# Altium schematic sheet Feedback.SchDoc
size Tabloid
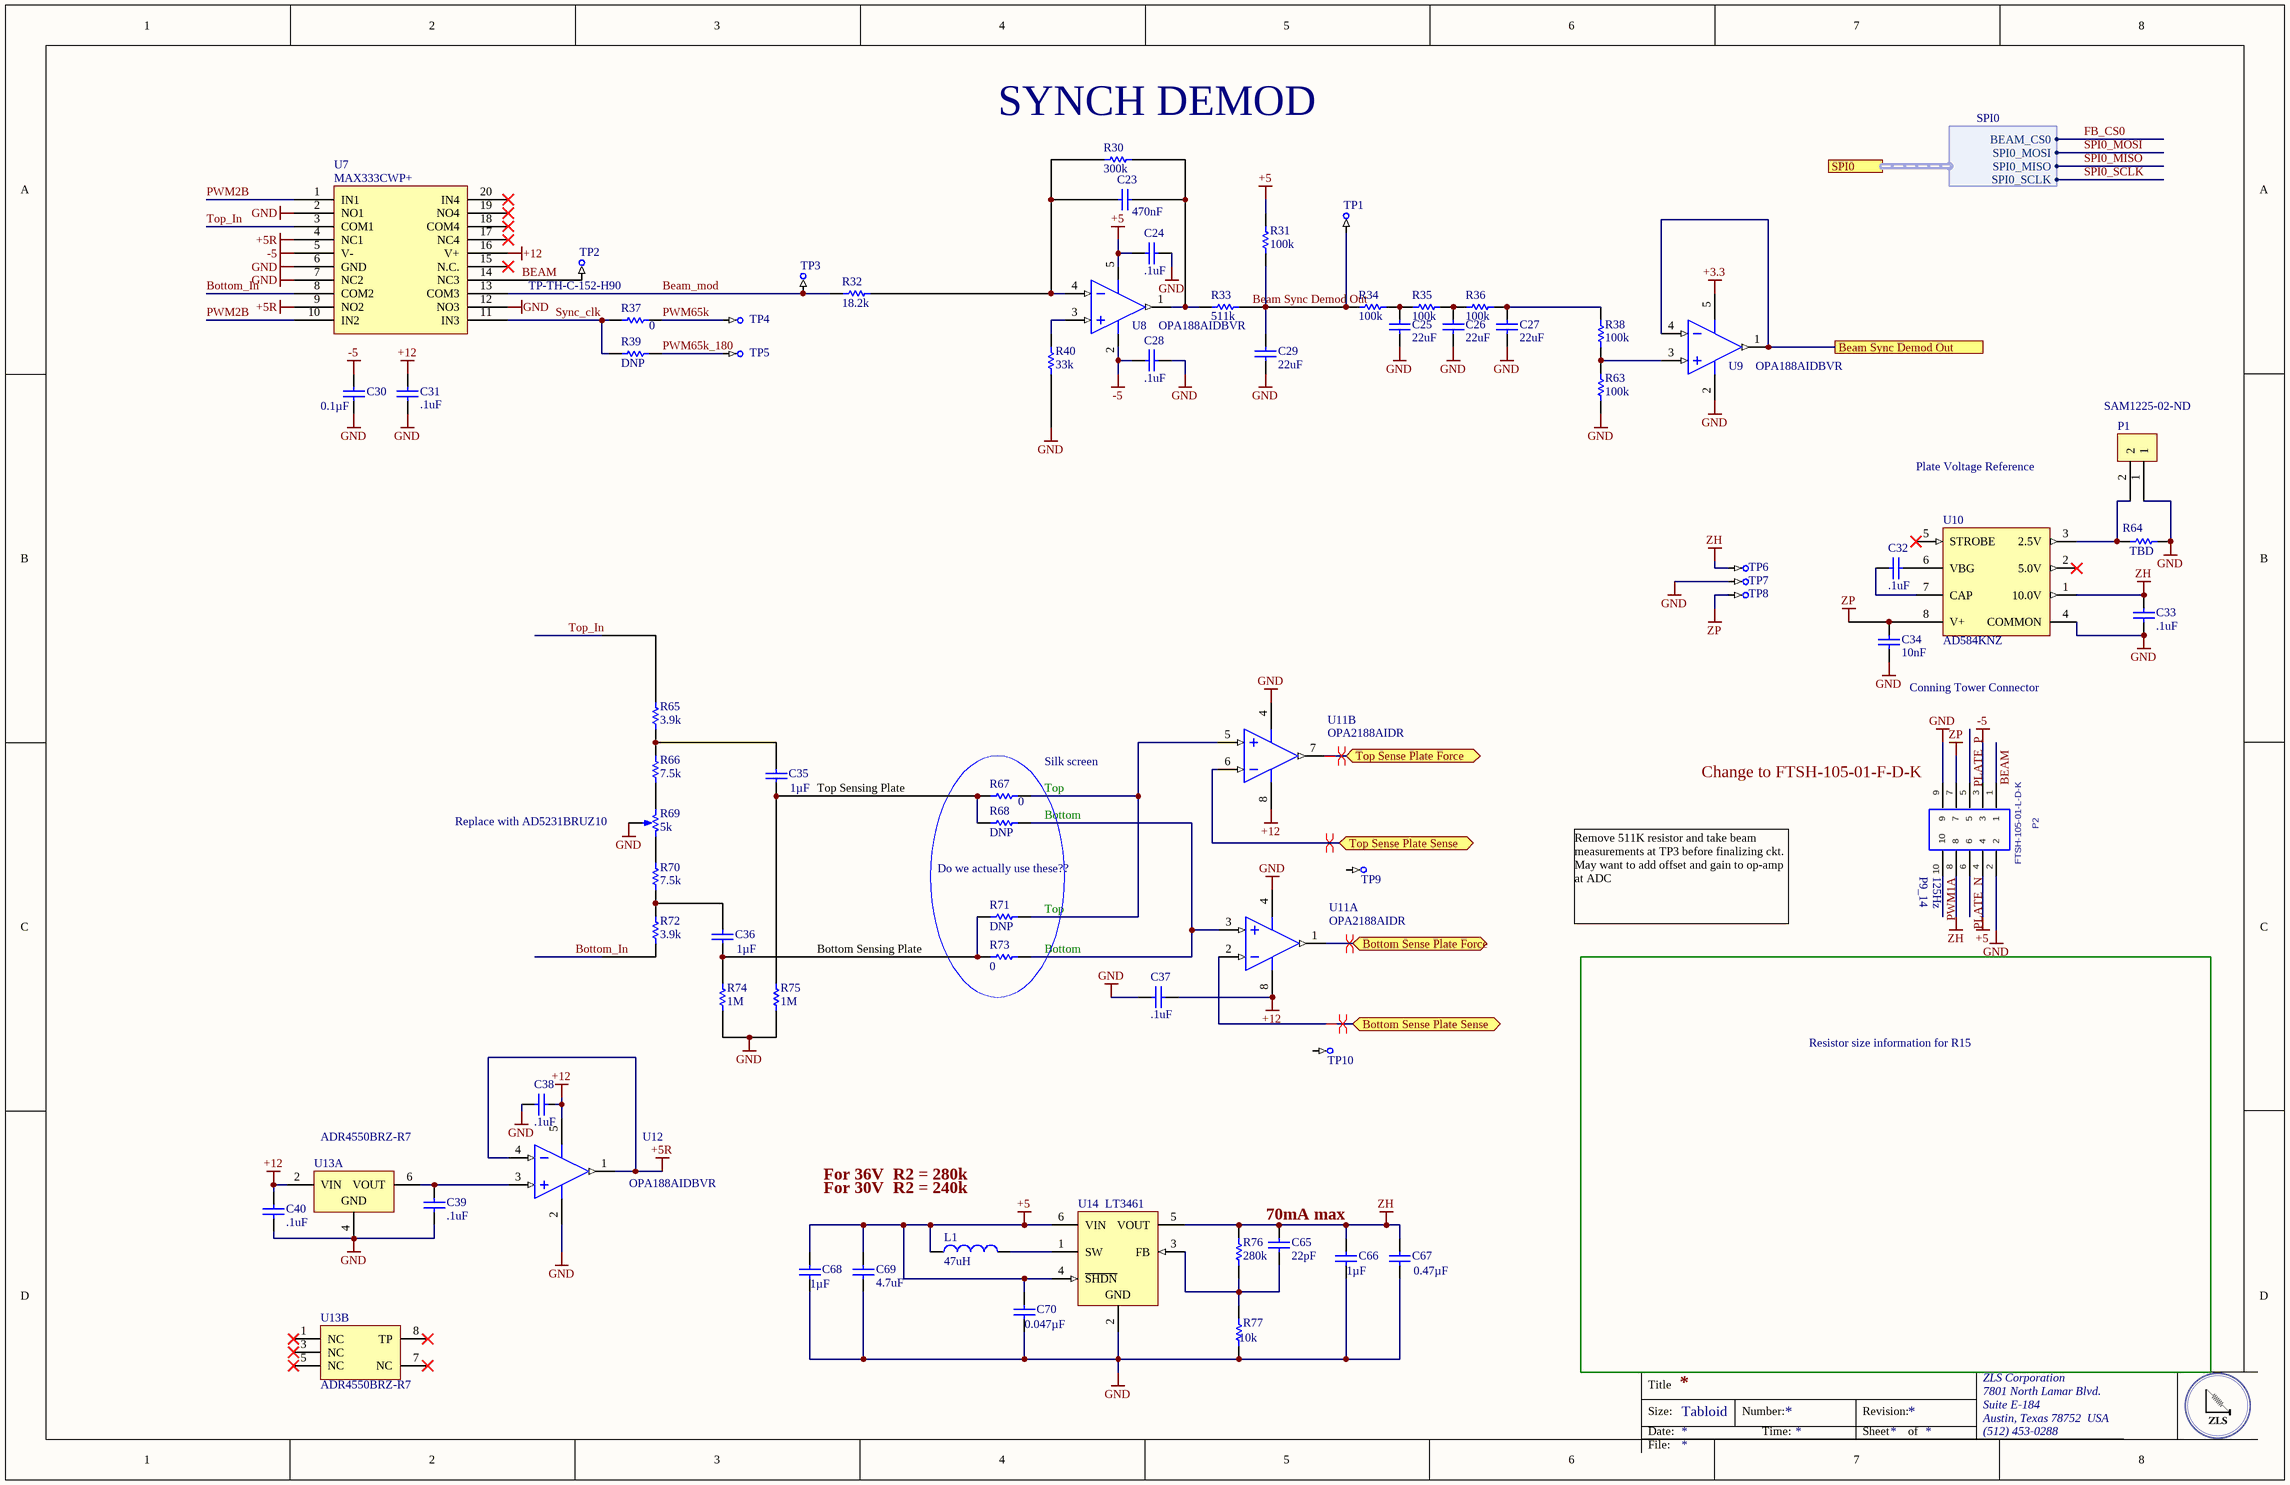
[diagram p0: Feedback.SchDoc]

## Parts
C23  470nF  [CAPC0805(2012)75_L]
C24  .1uF  [CAPC0805(2012)75_L]
C25  22uF  [CAPC0805(2012)75_L]
C26  22uF  [CAPC0805(2012)75_L]
C27  22uF  [CAPC0805(2012)75_L]
C28  .1uF  [CAPC0805(2012)75_L]
C29  22uF  [CAPC0805(2012)75_L]
C30  Capacitance: 0.1µF  [CAPC0805(2012)145_N]  (hidden comment: CAP CER 0.1UF 25V X7R 0805)
C31  .1uF  [CAPC0805(2012)75_L]
C32  .1uF  [CAPC0805(2012)75_M]
C33  .1uF  [CAPC0805(2012)75_M]
C34  Capacitance: 10nF  [CAPC0805(2012)145_N]  (hidden comment: Multilayer Ceramic Capacitors MLCC - SMD/SMT 0.01uF 50volts 10% X7R)
C35  Capacitance: 1µF  [CAPC0805(2012)155_L]  (hidden comment: CAP CER 1UF 25V X7R 0805)
C36  Capacitance: 1µF  [CAPC0805(2012)155_L]  (hidden comment: CAP CER 1UF 25V X7R 0805)
C37  .1uF  [CAPC0805(2012)75_M]
C38  .1uF  [CAPC0805(2012)75_M]
C39  .1uF  [CAPC0805(2012)75_M]
C40  .1uF  [CAPC0805(2012)75_M]
C65  22pF  [CAPC1206(3216)170_L]
C66  Capacitance: 1µF  [CAPC1210(3225)100_N]  (hidden comment: CAP CER 1UF 50V X7R 1210)
C67  Capacitance: 0.47µF  [CAPC1206(3216)190_N]  (hidden comment: CAP CER 0.47UF 50V X7R 1206)
C68  Capacitance: 1µF  [CAPC0805(2012)145_N]  (hidden comment: CAP CER 1UF 16V X7R 0805)
C69  4.7uF  [CAPC0805(2012)145_M]
C70  Capacitance: 0.047µF  [CAPC0805(2012)145_N]  (hidden comment: CAP CER 0.047UF 16V X7R 0603)
L1  47uH  [C1210]
P1  Supplier Part Number 1: SAM1225-02-ND  [SSW-102-02-G-S-RA]  (hidden comment: SSW-102-02-G-S-RA)
P2  FTSH-105-01-L-D-K  [FTSH-105-01-XXX-D-K]
R30  300k  [RESC0805(2012)_L]
R31  100k  [RESC0805(2012)_L]
R32  18.2k  [RESC0805(2012)_L]
R33  511k  [RESC0805(2012)_L]
R34  100k  [RESC0805(2012)_L]
R35  100k  [RESC0805(2012)_L]
R36  100k  [RESC0805(2012)_L]
R37  0  [RESC0805(2012)_L]
R38  100k  [RESC0805(2012)_L]
R39  DNP  [RESC0805(2012)_L]
R40  33k  [RESC0805(2012)_L]
R63  100k  [RESC0805(2012)_L]
R64  TBD  [VH102K]
R65  3.9k  [RESC0805(2012)_L]
R66  7.5k  [RESC0805(2012)_L]
R67  0  [RESC0805(2012)_L]
R68  DNP  [RESC0805(2012)_L]
R69  Resistance (Ohms): 5k  [Trimmer 2.54]  (hidden comment: TRIMMER 5K OHM 0.25W PC PIN)
R70  7.5k  [RESC0805(2012)_L]
R71  DNP  [RESC0805(2012)_L]
R72  3.9k  [RESC0805(2012)_L]
R73  0  [RESC0805(2012)_L]
R74  1M  [RESC0805(2012)_L]
R75  1M  [RESC0805(2012)_L]
R76  Resistance (Ohms): 280k  [RESC0805(2012)_M]  (hidden comment: RES SMD 280K OHM 1% 1/8W 0805)
R77  Resistance (Ohms): 10k  [RESC0805(2012)_M]  (hidden comment: RES SMD 10K OHM 1% 1/8W 0805)
TP1  TP-TH-C-152-H90  [TP-TH-C-152-H90]  (value not drawn)  (no BOM)
TP2  TP-TH-C-152-H90  [TP-TH-C-152-H90]  (no BOM)
TP3  TP-TH-C-152-H90  [TP-TH-C-152-H90]  (value not drawn)  (no BOM)
TP4  TP-TH-C-152-H90  [TP-TH-C-152-H90]  (value not drawn)  (no BOM)
TP5  TP-TH-C-152-H90  [TP-TH-C-152-H90]  (value not drawn)  (no BOM)
TP6  TP-TH-C-152-H90  [TP-TH-C-152-H90]  (value not drawn)  (no BOM)
TP7  TP-TH-C-152-H90  [TP-TH-C-152-H90]  (value not drawn)  (no BOM)
TP8  TP-TH-C-152-H90  [TP-TH-C-152-H90]  (value not drawn)  (no BOM)
TP9  TP-TH-C-152-H90  [TP-TH-C-152-H90]  (value not drawn)  (no BOM)
TP10  TP-TH-C-152-H90  [TP-TH-C-152-H90]  (value not drawn)  (no BOM)
U7  MAX333CWP+  [TSOP65P640X90-20N]
U8  OPA188AIDBVR  [DBV0005A_M]
U9  OPA188AIDBVR  [DBV0005A_M]
U10  AD584KNZ  [ADI-N-8]
U11  OPA2188AIDR  [D0008A_L]  (parts A,B of 2)
U12  OPA188AIDBVR  [DBV0005A_M]
U13  ADR4550BRZ-R7  [ADI-R-8_M]  (parts A,B of 2)
U14  LT3461  [LT-S6-6-TSOT-23_N]

## Ports
Beam Sync Demod Out, Bottom Sense Plate Force, Bottom Sense Plate Sense, SPI0 (harness SPI0), Top Sense Plate Force, Top Sense Plate Sense

## Harnesses
SPI0: BEAM_CS0, SPI0_MOSI, SPI0_MISO, SPI0_SCLK

## Nets
+3.3: U9.5(V+)
+5: C24.1 C68.2 C69.2 C70.2 L1.1 P2.4 R31.2 U8.5(V+) U14.4(~{SHDN}) U14.6(VIN)
+5R: U7.4(NC1) U7.9(NO2) U12.1(OUT) U12.4(IN-)
+12: C31.2 C37.2 C38.2 C40.2 U7.16(V+) U11.8(V+) U12.5(V+) U13.2(VIN)
-5: C28.1 C30.1 P2.3 U7.5(V-) U8.2(V-)
GND: C24.2 C25.1 C26.1 C27.1 C28.2 C29.1 C30.2 C31.1 C33.1 C34.2 C37.1 C38.1 C39.1 C40.1 C66.1 C67.1 C68.1 C69.1 C70.1 P1.1 P2.2 P2.9 R40.1 R63.1 R64.2 R69.2(b) R74.1 R75.1 R77.2 TP7.1 U7.2(NO1) U7.6(GND) U7.7(NC2) U7.12(NO3) U9.2(V-) U10.4(COMMON) U11.4(V-) U12.2(V-) U13.4(GND) U14.2(GND)
ZH: C33.2 C65.2 C66.2 C67.2 P2.8 R76.1 TP6.1 U10.1(10.0V) U14.5(VOUT)
ZP: C34.1 P2.7 TP8.1 U10.8(V+)
BEAM: P2.1 TP2.1 U7.14(NC3)
Beam Sync Demod Out: C29.2 R31.1 R33.1 R34.2 TP1.1
Beam Sync Demod Out: U9.1(OUT) U9.4(IN-) ; port Beam Sync Demod Out  [a separate net that carries the same name]
Beam_mod: R32.2 TP3.1 U7.13(COM3)
Bottom Sense Plate Force: U11.1(OUT_A) ; port Bottom Sense Plate Force
Bottom Sense Plate Sense: U11.2(IN_A-) ; port Bottom Sense Plate Sense
Bottom_In: R72.1 U7.8(COM2)
FB_CS0: port SPI0.BEAM_CS0
PLATE_N: P2.6
PLATE_P: P2.5
PWM1A: P2.10
PWM2B: U7.1(IN1) U7.10(IN2)
PWM65k: R37.1 TP4.1
PWM65k_180: R39.1 TP5.1
SPI0_MISO: port SPI0.SPI0_MISO
SPI0_MOSI: port SPI0.SPI0_MOSI
SPI0_SCLK: port SPI0.SPI0_SCLK
Sync_clk: R37.2 R39.2 U7.11(IN3)
Top Sense Plate Force: U11.7(OUT_B) ; port Top Sense Plate Force
Top Sense Plate Sense: U11.6(IN_B-) ; port Top Sense Plate Sense
Top_In: R65.2 U7.3(COM1)
NetC23_1: C23.1 R30.2 R32.1 U8.4(IN-)
NetC23_2: C23.2 R30.1 R33.2 U8.1(OUT)
NetC25_2: C25.2 R34.1 R35.2
NetC26_2: C26.2 R35.1 R36.2
NetC27_2: C27.2 R36.1 R38.2
NetC32_1: C32.1 U10.7(CAP)
NetC32_2: C32.2 U10.6(VBG)
NetC35_1: C35.1 R67.2 R68.2 R75.2
NetC35_2: C35.2 R65.1 R66.2
NetC36_1: C36.1 R71.2 R73.2 R74.2
NetC36_2: C36.2 R70.1 R72.2
NetC39_2: C39.2 U12.3(IN+) U13.6(VOUT)
NetC65_1: C65.1 R76.2 R77.1 U14.3(FB)
NetL1_2: L1.2 U14.1(SW)
NetP1_2: P1.2 R64.1 U10.3(2.5V)
NetR38_1: R38.1 R63.2 U9.3(IN+)
NetR40_2: R40.2 U8.3(IN+)
NetR66_1: R66.1 R69.1(a)
NetR67_1: R67.1 R71.1 U11.5(IN_B+)
NetR68_1: R68.1 R73.1 U11.3(IN_A+)
NetR69_3: R69.3(c) R70.2

Not connected (* = marked no-connect by the designer): TP9 1; TP10 1; U7 15(N.C.)* 17(NC4)* 18(COM4)* 19(NO4)* 20(IN4)*; U10 2(5.0V)* 5(STROBE)*; U13 1(NC)* 3(NC)* 5(NC)* 7(NC)* 8(TP)*

## Layout directives
differential pair: Bottom Sense Plate Force, Bottom Sense Plate Sense, Top Sense Plate Force, Top Sense Plate Sense

## Notes on the sheet
- (near R30) SYNCH DEMOD
- Plate Voltage Reference
- Conning Tower Connector
- Silk screen
- (near R69) Replace with AD5231BRUZ10
- (near C35) Top Sensing Plate
- Top
- Bottom
- (near P2) Change to FTSH-105-01-F-D-K
- Do we actually use these??
- (near P2) P9_14
- (near P2) 125Hz
- Bottom Sensing Plate
- (near R71) Top
- Remove 511K resistor and take beam measurements at TP3 before finalizing ckt.
  May want to add offset and gain to op-amp at ADC
- Resistor size information for R15
- For 36V  R2 = 280k
- For 30V  R2 = 240k
- (near C65) 70mA max
- Title
- Size:
- Date:
- Tabloid
- Number:
- Time:
- Revision:
- Sheet
- of
- ZLS Corporation
- 7801 North Lamar Blvd.
- Suite E-184
- Austin, Texas 78752  USA
- (512) 453-0288
- File:

## Library data of the parts
C23 = CMP-1036-02117-1: CAP 150pF 16V ±10% 0805 (2012 Metric) Thickness 0.75mm SMD; Case-EIA: 0805; Tolerance: Â±10%; Value: .47uF; Case-Metric: 2012; Technology: SMT; Max Thickness: 0.75 mm; Rated Voltage: 16 V
C24-C29 C31 = CMP-1036-02117-1: CAP 150pF 16V ±10% 0805 (2012 Metric) Thickness 0.75mm SMD; Case-EIA: 0805; Tolerance: Â±10%; Case-Metric: 2012; Technology: SMT; Max Thickness: 0.75 mm; Rated Voltage: 16 V
  C24 C28 C31: Value: .1uF
  C25-C27 C29: Value: 22uF
C30 = CMP-1036-04795-1: Manufacturer: Murata Electronics North America; Manufacturer Part Number: GRM21BR71E104KA01L; Tolerance: ±10%; Supplier 1: Digi-Key; Supplier Part Number 1: 490-1673-6-ND; RoHS: RoHS Compliant; Category: Capacitors; Stock 1: 891652; Pricing 1: 1=0.2, 10=0.145, 100=0.0683, 500=0.04788, 1000=0.03964 (USD); Packaging: Digi-Reel®; Part Status: Active; Voltage - Rated: 25V; Temperature Coefficient: X7R; Operating Temperature: -55°C ~ 125°C; Features: -; Ratings: -; Applications: General Purpose; Mounting Type: Surface Mount, MLCC; Package / Case: 0805 (2012 Metric); Size / Dimension: 0.079" L x 0.049" W (2.00mm x 1.25mm); Height - Seated (Max): -; Thickness (Max): 0.053" (1.35mm); Lead Spacing: -; Lead Style: -; ComponentLink1URL: http://www.murata.com/~/media/webrenewal/support/library/catalog/products/capacitor/mlcc/c02e.ashx; ComponentLink1Description: http://www.murata.com/~/media/webrenewal/support/library/catalog/products/capacitor/mlcc/c02e.ashx
C32 C33 C37-C40 = CMP-1036-01414-1: CAP 33pF 25V ±2% 0805 (2012 Metric) Thickness 0.75mm SMD; Tolerance: Â±2%; Case-Metric: 2012; Case-EIA: 0805; Value: .1uF; Max Thickness: 0.75 mm; Rated Voltage: 25 V; Technology: SMT
C34 = CMP-1036-04795-1: Manufacturer: Kemet; Manufacturer Part Number: C0805C103K5RACAUTO; Voltage Rating: 50V; Supplier 1: Digi-Key; Supplier Part Number 1: 399-6924-1-ND; Stock 1: 63236; Pricing 1: 1=0.12, 10=0.087, 100=0.041, 500=0.0287, 1000=0.0238 (USD); Mount: Surface Mount; Case/Package: 0805; Case Code (Metric): 2012; Case Code (Imperial): 0805; Dielectric Material: Ceramic; Contact Plating: Tin; Min Operating Temperature: -55°C; Max Operating Temperature: 125°C; Tolerance: 10%; Packaging: Tape and Reel; Package Quantity: 1; Voltage Rating (DC): 50V; Dielectric: X7R; Termination: SMD/SMT; Length: 2mm; Height: 0.78mm; Width: 0.049inch; Thickness: 0.035inch; Depth: 1.25mm; Radiation Hardening: No; REACH SVHC: No SVHC; ComponentLink1URL: https://datasheet.ciiva.com/22700/1693454-22700519.pdf; ComponentLink1Description: https://datasheet.ciiva.com/22700/1693454-22700519.pdf; ComponentLink2URL: https://datasheet.ciiva.com/7842/1693454-7842175.pdf; ComponentLink2Description: https://datasheet.ciiva.com/7842/1693454-7842175.pdf
C35 C36 = CMP-1036-04882-1: Manufacturer: Murata Electronics North America; Manufacturer Part Number: GRM21BR71E105KA99L; Tolerance: ±10%; Supplier 1: Digi-Key; Supplier Part Number 1: 490-6484-6-ND; RoHS: RoHS Compliant; Category: Capacitors; Stock 1: 295074; Pricing 1: 1=0.14, 10=0.099, 100=0.0468, 500=0.0328, 1000=0.02715 (USD); Packaging: Digi-Reel®; Part Status: Active; Voltage - Rated: 25V; Temperature Coefficient: X7R; Operating Temperature: -55°C ~ 125°C; Features: -; Ratings: -; Applications: General Purpose; Mounting Type: Surface Mount, MLCC; Package / Case: 0805 (2012 Metric); Size / Dimension: 0.079" L x 0.049" W (2.00mm x 1.25mm); Height - Seated (Max): -; Thickness (Max): 0.053" (1.35mm); Lead Spacing: -; Lead Style: -; ComponentLink1URL: http://www.murata.com/~/media/webrenewal/support/library/catalog/products/capacitor/mlcc/c02e.ashx; ComponentLink1Description: http://www.murata.com/~/media/webrenewal/support/library/catalog/products/capacitor/mlcc/c02e.ashx
C65 = CMP-1037-04573-1: CAP CER 22PF 50V C0G/NP0 1206; Manufacturer: KEMET; Manufacturer Part Number: C1206C220K5GACTU; Tolerance: ±10%; Temperature Coefficient: C0G, NP0; Supplier 1: Digi-Key; Supplier Part Number 1: 399-8165-1-ND; RoHS: RoHS Compliant; Category: Capacitors; Stock 1: 35613; Pricing 1: 1=0.18, 10=0.128, 100=0.06, 500=0.04208, 1000=0.03483 (USD); Packaging: Cut Tape (CT); Part Status: Active; Voltage - Rated: 50V; Operating Temperature: -55°C ~ 125°C; Features: Low ESL; Ratings: -; Applications: General Purpose; Failure Rate: -; Mounting Type: Surface Mount, MLCC; Package / Case: 1206 (3216 Metric); Size / Dimension: 0.126" L x 0.063" W (3.20mm x 1.60mm); Height - Seated (Max): -; Thickness (Max): 0.035" (0.88mm); Lead Spacing: -; Lead Style: -; ComponentLink1URL: http://www.kemet.com/docfinder?Partnumber=C1206C220K2GACTU; ComponentLink1Description: http://www.kemet.com/docfinder?Partnumber=C1206C220K2GACTU
C66 = CMP-1038-01123-1: Manufacturer: Taiyo Yuden; Manufacturer Part Number: UMK325B7105KH-T; Tolerance: ±10%; Supplier 1: Digi-Key; Supplier Part Number 1: 587-1366-1-ND; RoHS: RoHS Compliant; Category: Capacitors; Stock 1: 23864; Pricing 1: 1=0.36, 10=0.247, 100=0.1398, 500=0.0987, 1000=0.08637 (USD); Packaging: Cut Tape (CT); Part Status: Active; Voltage - Rated: 50V; Temperature Coefficient: X7R; Operating Temperature: -55°C ~ 125°C; Features: -; Ratings: -; Applications: General Purpose; Mounting Type: Surface Mount, MLCC; Package / Case: 1210 (3225 Metric); Size / Dimension: 0.126" L x 0.098" W (3.20mm x 2.50mm); Height - Seated (Max): -; Thickness (Max): 0.063" (1.60mm); Lead Spacing: -; Lead Style: -; ComponentLink1URL: http://www.yuden.co.jp/productdata/catalog/en/mlcc_all_e.pdf; ComponentLink1Description: http://www.yuden.co.jp/productdata/catalog/en/mlcc_all_e.pdf
C67 = CMP-1037-04570-1: Manufacturer: Taiyo Yuden; Manufacturer Part Number: UMK316B7474KL-T; Tolerance: ±10%; Supplier 1: Digi-Key; Supplier Part Number 1: 587-1325-1-ND; RoHS: RoHS Compliant; Category: Capacitors; Stock 1: 8658; Pricing 1: 1=0.3, 10=0.203, 100=0.115, 500=0.08114, 1000=0.071 (USD); Packaging: Cut Tape (CT); Part Status: Active; Voltage - Rated: 50V; Temperature Coefficient: X7R; Operating Temperature: -55°C ~ 125°C; Features: -; Ratings: -; Applications: General Purpose; Mounting Type: Surface Mount, MLCC; Package / Case: 1206 (3216 Metric); Size / Dimension: 0.126" L x 0.063" W (3.20mm x 1.60mm); Height - Seated (Max): -; Thickness (Max): 0.071" (1.80mm); Lead Spacing: -; Lead Style: -; ComponentLink1URL: http://www.yuden.co.jp/productdata/catalog/en/mlcc_all_e.pdf; ComponentLink1Description: http://www.yuden.co.jp/productdata/catalog/en/mlcc_all_e.pdf
C68 = CMP-1036-04795-1: Manufacturer: Taiyo Yuden; Manufacturer Part Number: EMK212B7105KG-T; Tolerance: ±10%; Supplier 1: Digi-Key; Supplier Part Number 1: 587-1283-1-ND; RoHS: RoHS Compliant; Category: Capacitors; Stock 1: 41495; Pricing 1: 1=0.13, 10=0.089, 100=0.042, 1000=0.02439 (USD); Packaging: Cut Tape (CT); Part Status: Active; Voltage - Rated: 16V; Temperature Coefficient: X7R; Operating Temperature: -55°C ~ 125°C; Features: -; Ratings: -; Applications: General Purpose; Mounting Type: Surface Mount, MLCC; Package / Case: 0805 (2012 Metric); Size / Dimension: 0.079" L x 0.049" W (2.00mm x 1.25mm); Height - Seated (Max): -; Thickness (Max): 0.053" (1.35mm); Lead Spacing: -; Lead Style: -; ComponentLink1URL: http://ds.yuden.co.jp/TYCOMPAS/ut/detail.do?productNo=EMK212B7105KG-T&fileName=EMK212B7105KG-T_SS&mode=specSheetDownload; ComponentLink1Description: http://ds.yuden.co.jp/TYCOMPAS/ut/detail.do?productNo=EMK212B7105KG-T&fileName=EMK212B7105KG-T_SS&mode=specSheetDownload
C69 = CMP-1036-04750-1: CAP CER 4.7UF 16V X7R 0805; Manufacturer: KEMET; Manufacturer Part Number: C0805C475K4RACTU; Tolerance: ±10%; Supplier 1: Digi-Key; Supplier Part Number 1: 399-7415-1-ND; RoHS: RoHS Compliant; Category: Capacitors; Stock 1: 88820; Pricing 1: 1=0.26, 10=0.176, 100=0.0894, 500=0.06118, 1000=0.05412 (USD); Packaging: Cut Tape (CT); Part Status: Active; Voltage - Rated: 16V; Temperature Coefficient: X7R; Operating Temperature: -55°C ~ 125°C; Features: Low ESL; Ratings: -; Applications: General Purpose; Failure Rate: -; Mounting Type: Surface Mount, MLCC; Package / Case: 0805 (2012 Metric); Size / Dimension: 0.079" L x 0.049" W (2.00mm x 1.25mm); Height - Seated (Max): -; Thickness (Max): 0.055" (1.40mm); Lead Spacing: -; Lead Style: -; ComponentLink1URL: http://www.kemet.com/docfinder?Partnumber=C0805C475K4RACTU; ComponentLink1Description: http://www.kemet.com/docfinder?Partnumber=C0805C475K4RACTU
C70 = CMP-1036-04795-1: Manufacturer: Murata Electronics North America; Manufacturer Part Number: GRM188R71C473KA01D; Tolerance: ±10%; Supplier 1: Digi-Key; Supplier Part Number 1: 490-1529-6-ND; RoHS: RoHS Compliant; Category: Capacitors; Stock 1: 26; Pricing 1: 1=0.1, 10=0.046, 100=0.0206, 500=0.0147, 1000=0.01155 (USD); Packaging: Digi-Reel®; Part Status: Active; Voltage - Rated: 16V; Temperature Coefficient: X7R; Operating Temperature: -55°C ~ 125°C; Features: -; Ratings: -; Applications: General Purpose; Mounting Type: Surface Mount, MLCC; Package / Case: 0603 (1608 Metric); Size / Dimension: 0.063" L x 0.031" W (1.60mm x 0.80mm); Height - Seated (Max): -; Thickness (Max): 0.035" (0.90mm); Lead Spacing: -; Lead Style: -; ComponentLink1URL: http://www.murata.com/~/media/webrenewal/support/library/catalog/products/capacitor/mlcc/c02e.ashx; ComponentLink1Description: http://www.murata.com/~/media/webrenewal/support/library/catalog/products/capacitor/mlcc/c02e.ashx
L1 = Inductor: FIXED IND 47UH 170MA 1.3 OHM SMD; Manufacturer: Murata Electronics North America; Manufacturer Part Number: LQH32CN470K23L; Type: Wirewound; Material - Core: Ferrite; Tolerance: ±10%; Shielding: Unshielded; DC Resistance (DCR): 1.69 Ohm Max; Supplier 1: Digi-Key; Supplier Part Number 1: 490-2497-1-ND; RoHS: RoHS Compliant; Category: Inductors, Coils, Chokes; Stock 1: 1058; Pricing 1: 1=0.33, 10=0.297, 100=0.2043, 500=0.17458, 1000=0.13372 (USD); Packaging: Cut Tape (CT); Part Status: Active; Q @ Freq: -; Ratings: -; Operating Temperature: -40°C ~ 85°C; Mounting Type: Surface Mount; Package / Case: Nonstandard; Supplier Device Package: 1210; Size / Dimension: 0.126" L x 0.098" W (3.20mm x 2.50mm); Height - Seated (Max): 0.067" (1.70mm); ComponentLink1URL: http://search.murata.co.jp/Ceramy/image/img/P02/JELF243A-0039.pdf; ComponentLink1Description: http://search.murata.co.jp/Ceramy/image/img/P02/JELF243A-0039.pdf
P2 = FTSH-105-01-XXX-D-K: TERMINAL STRIP, .050"(1.27mm) PITCH, 10 PINS, KEYING OPTION.; MANUFACTURER: SAMTEC; PCB DECAL: FTSH-105-01-F-DV-K; CREATED: September 26, 2016 - Wendy Xin
R30-R38 R40 R63 R65-R67 R70 R72-R75 = CMP-1013-00215-1: 2R55 0.125W 1% 0805 (2012 Metric)  SMD; Case-Metric: 2012; Case-EIA: 0805; Tolerance: 1 %; Technology: SMT; Power: 0.125 W
  R30: Value: 300k
  R31 R34-R36 R38 R63: Value: 100k
  R32: Value: 18.2k
  R33: Value: 511k
  R37 R67 R73: Value: 0
  R40: Value: 33k
  R65 R72: Value: 3.9k
  R66 R70: Value: 7.5k
  R74 R75: Value: 1M
R39 R68 R71 = CMP-1013-00215-1: 2R55 0.125W 1% 0805 (2012 Metric)  SMD; Case-Metric: 2012; Value: 0; Case-EIA: 0805; Tolerance: 1 %; Technology: SMT; Power: 0.125 W
R64 = CMP-1013-00393-1
R69 = Trimmer: Manufacturer: Vishay Foil Resistors (Division of Vishay Precision Group); Manufacturer Part Number: Y00535K00000J0L; Power (Watts): 0.25W, 1/4W; Tolerance: ±5%; Temperature Coefficient: ±10ppm/°C; Number of Turns: 21; Adjustment Type: Side Adjustment; Resistive Material: Metal Foil; Supplier 1: Digi-Key; Supplier Part Number 1: 804-1020-ND; RoHS: RoHS Compliant; Category: Potentiometers, Variable Resistors; Stock 1: 679; Pricing 1: 1=34.42, 10=32.265, 25=26.5292, 50=22.944, 100=22.227, 250=20.793, 500=19.2156 (USD); Packaging: Bulk; Part Status: Active; Mounting Type: Through Hole; Termination Style: PC Pins; Size / Dimension: Rectangular - 0.250" x 0.175" Face x 0.250" L (6.35mm x 4.45mm x 6.35mm); ComponentLink1URL: http://www.vishaypg.com/docs/63053/1240.pdf; ComponentLink1Description: http://www.vishaypg.com/docs/63053/1240.pdf
R76 = CMP-1013-00017-1: Manufacturer: Vishay Dale; Manufacturer Part Number: CRCW0805280KFKEA; Power (Watts): 0.125W, 1/8W; Temperature Coefficient: ±100ppm/°C; Supplier 1: Digi-Key; Supplier Part Number 1: 541-280KCTR-ND; RoHS: RoHS Compliant; Category: Resistors; Stock 1: 10000; Pricing 1: 5000=0.00546, 10000=0.00474, 25000=0.00417, 50000=0.00382, 125000=0.00375 (USD); Packaging: Tape & Reel (TR); Part Status: Active; Tolerance: ±1%; Composition: Thick Film; Features: Automotive AEC-Q200; Operating Temperature: -55°C ~ 155°C; Package / Case: 0805 (2012 Metric); Supplier Device Package: 0805; Size / Dimension: 0.079" L x 0.049" W (2.00mm x 1.25mm); Height - Seated (Max): 0.020" (0.50mm); Failure Rate: -; ComponentLink1URL: http://www.vishay.com/docs/20035/dcrcwe3.pdf; ComponentLink1Description: http://www.vishay.com/docs/20035/dcrcwe3.pdf
R77 = CMP-1013-00017-1: Manufacturer: Yageo; Manufacturer Part Number: RC0805FR-0710KL; Power (Watts): 0.125W, 1/8W; Temperature Coefficient: ±100ppm/°C; Supplier 1: Digi-Key; Supplier Part Number 1: 311-10.0KCRCT-ND; RoHS: RoHS Compliant; Category: Resistors; Stock 1: 13336570; Pricing 1: 1=0.1, 10=0.022, 100=0.0088, 1000=0.00396, 2500=0.00344 (USD); Packaging: Cut Tape (CT); Part Status: Active; Tolerance: ±1%; Composition: Thick Film; Features: Moisture Resistant; Operating Temperature: -55°C ~ 155°C; Package / Case: 0805 (2012 Metric); Supplier Device Package: 0805; Size / Dimension: 0.079" L x 0.049" W (2.00mm x 1.25mm); Height - Seated (Max): 0.024" (0.60mm); Failure Rate: -; ComponentLink1URL: http://www.yageo.com/documents/recent/PYu-RC_Group_51_RoHS_L_7.pdf; ComponentLink1Description: http://www.yageo.com/documents/recent/PYu-RC_Group_51_RoHS_L_7.pdf
TP1-TP10 = CMP-0484-00003-2: Test Point, Through Hole, Hole Size 0.9 mm, PCB Mount with Silkscreen Box; Manufacturer: No Vendor; PartNumber: TP-TH-C-152-H90
U7 = MAX333CWP+: IC SWITCH QUAD SPDT 20TSSOP; Manufacturer: Maxim; Manufacturer Part Number: MAX333AEUP+; Max Supply Voltage: 30V; Min Supply Voltage: 10V; Min Dual Supply Voltage: 4.5V; Max Dual Supply Voltage: 20V; On-State Resistance: 35R; Operating Supply Current: 1uA; Supply Type: Single,Dual; Max Power Dissipation: 559mW; Turn-On Delay Time: 175ns; Turn-Off Delay Time: 145ns; Max Supply Current: 250uA; Number of Bits: 4; Dual Supply Voltage: 15V; Supplier 1: Mouser; Supplier Part Number 1: 700-MAX333AEUP; Stock 1: 664; Pricing 1: 1=6.77, 10=6.43, 50=5.8, 100=5.8, 1000=5.62, 10000=5.62 (USD); Case/Package: TSSOP; Number of Pins: 20; Weight: 0.006737oz; Min Operating Temperature: -40°C; Max Operating Temperature: 85°C; Packaging: Rail/Tube; Package Quantity: 74; Throw Configuration: SPDT; Number of Channels: 4; Length: 6.6mm; Height: 0.95mm; Width: 4.5mm; Radiation Hardening: No; Lead Free: Lead Free; REACH SVHC: Unknown; ComponentLink1URL: https://datasheet.ciiva.com/2978/max333a-2978850.pdf; ComponentLink1Description: https://datasheet.ciiva.com/2978/max333a-2978850.pdf; ComponentLink2URL: https://datasheet.ciiva.com/30478/0900766b81253c85-30478260.pdf; ComponentLink2Description: https://datasheet.ciiva.com/30478/0900766b81253c85-30478260.pdf; ComponentLink3URL: https://datasheet.ciiva.com/1674/max333a-1674617.pdf; ComponentLink3Description: https://datasheet.ciiva.com/1674/max333a-1674617.pdf; ComponentLink4URL: https://datasheet.ciiva.com/26825/max333aeup-26825546.pdf; ComponentLink4Description: https://datasheet.ciiva.com/26825/max333aeup-26825546.pdf
U8 U9 U12 = CMP-0809-00005-2: Precision, Low Noise, Rail-to-Rail Output, Zero-Drift Operational Amplifier, 4 to 36 V, -40 to 125 degC, 5-pin SOT23 (DBV5), Green (RoHS & no Sb/Br); Manufacturer: Texas Instruments; Total Supply Voltage(Min)(+5V is 5, +/-5V is 10): 4; Offset Drift(Typ)(uV/C): 0.03; Rating: Catalog; SubFamily: Zero Drift Precision Amplifier; GBW(Typ)(MHz): 2; Slew Rate(Typ)(V/us): 0.8; Number of Channels: 1; CMRR(Min)(dB): 120; Iq per channel(Max)(mA): 0.51; Total Supply Voltage(Max)(+5V is 5, +/-5V is 10): 36; PartNumber: OPA188AIDBVR; ComponentLink2Description: Datasheet; ComponentLink2URL: http://www.ti.com/lit/ds/symlink/opa188.pdf; ComponentLink1Description: Manufacturer URL; Mounting Technology: Surface Mount; Eco-Plan: Green (RoHS & no Sb/Br); ComponentLink1URL: http://www.ti.com/; PackageVersion: 4073253-4/K, 03/2006; DatasheetVersion: SBOS642A; ComponentLink3Description: Package Specification; PackageReference: DBV0005A; ComponentLink3URL: http://www.ti.com/litv/pdf/mpds018i; PackageDescription: 5-Pin Plastic Small Outline, Body 1.6 x 2.9 mm, Pitch 0.95 mm; Code_JEDEC: MO-178
U10 = CMP-0784-00054-1: Pin Programmable, Precision Voltage Reference, + 2.5 / + 5 / + 7.5 / + 10 Prog V Output, 4.5 to 30 V Supply, Commercial, 8-pin DIP (N-8), Tube; Manufacturer: Analog Devices; Max V Supply (V): 30; Min V Supply (V): 4.5; Ref Out TC (ppm/C): 15; Vout: 2.5V, 5V, 7.5V, 10V; ComponentLink3URL: http:/www.analog.com/static/imported-files/packages/PKG_PDF/PDIP(N)/N_8.pdf; ComponentLink1URL: http://www.analog.com/en/index.html; PartNumber: AD584KNZ; ComponentLink1Description: Manufacturer URL; ComponentLink2Description: Datasheet; PackageDescription: 8-Pin Plastic Dual In-Line Package, Row spacing 7.62 mm, Pitch 2.54 mm; Operating Temp Range: 0 to 70 degC; DatasheetVersion: Rev. C; Code_JEDEC: MS-001; Packing: Tube; ComponentLink3Description: Package Specification; PackageReference: N-8; ComponentLink4Description: URL Link1; Mounting Technology: Through Hole; PackageVersion: 070606-A, 07/2006; ComponentLink4URL: Product URL:http://www.analog.com/en/special-linear-functions/voltage-references/ad584/products/product.html; ComponentLink2URL: http://www.analog.com/static/imported-files/data_sheets/AD584.pdf
U11 = CMP-0272-00241-3: 0.03 uV/degC, 6 uV Vos, Low Noise, Rail-to-Rail Output, Zero-Drift Operational Amplifier, 4 to 36 V, -40 to 105 degC, 8-pin SOIC (D8), Green (RoHS & no Sb/Br); Manufacturer: Texas Instruments; Number of Circuits: 2; Slew Rate: 0.8 V/µs; Current - Supply: 415µA; Current - Output / Channel: 18mA; Voltage - Supply, Single/Dual (±): 4 V ~ 36 V, ±2 V ~ 18 V; Supplier 1: Digi-Key; Supplier Part Number 1: 296-29454-6-ND; Manufacturer Part Number: OPA2188AIDR; RoHS: RoHS Compliant; Category: Integrated Circuits (ICs); Stock 1: 8272; Pricing 1: 1=3.44, 10=3.089, 100=2.5307, 500=2.15434, 1000=1.81692 (USD); Packaging: Digi-Reel®; Part Status: Active; Amplifier Type: Zero-Drift; Output Type: Rail-to-Rail; -3db Bandwidth: -; Operating Temperature: -40°C ~ 105°C; Mounting Type: Surface Mount; Package / Case: 8-SOIC (0.154", 3.90mm Width); Supplier Device Package: 8-SOIC; ComponentLink1URL: http://www.ti.com/lit/ds/symlink/opa2188.pdf; ComponentLink1Description: http://www.ti.com/lit/ds/symlink/opa2188.pdf
U13 = CMP-0784-00191-1: Ultralow Noise, High Accuracy Voltage Reference, 5 V Output, 3 to 15 V Supply, Industrial, 8-pin SOIC (R-8), Reel; Manufacturer: Analog Devices; Max V Supply (V): 15; Vout: 5V; Ref Out TC (ppm/C): 2; Min V Supply (V): 3; ComponentLink1Description: Manufacturer URL; Mounting Technology: Surface Mount; PackageReference: R-8; ComponentLink2Description: Datasheet; ComponentLink3Description: Package Specification; PackageVersion: 060506-A, 06/2006; PackageDescription: 8-Pin Standard Small Outline Package, Body 4.9 x 3.9 mm, Pitch 1.27 mm; DatasheetVersion: Rev. 0; Packing: Reel; PartNumber: ADR4550BRZ-R7; Operating Temp Range: -40 to 125 degC; ComponentLink4URL: Product URL:http://www.analog.com/en/special-linear-functions/voltage-references/adr4550/products/product.html; Code_JEDEC: MS-012-AA; ComponentLink3URL: http://www.analog.com/static/imported-files/packages/PKG_PDF/SOIC_Narrow%20(R)/R_8.pdf; ComponentLink2URL: http://www.analog.com/static/imported-files/data_sheets/ADR4520_4525_4530_4533_4540_4550.pdf; ComponentLink4Description: URL Link1; ComponentLink1URL: http://www.analog.com/en/index.html; PartId: 1
U14 = CMP-0491-01698-1: IC REG BOOST ADJ 0.3A TSOT23-6; Manufacturer 1: Linear Technology; Manufacturer Part Number 1: LT3461AES6#TRMPBF; Category 1: Integrated Circuits (ICs); Function: Step-Up; Output Configuration: Positive; Output Type: Adjustable; Number of Outputs: 1; Voltage - Input (Min): 2.5V; Voltage - Input (Max): 16V; Voltage - Output (Min/Fixed): 1.255V; Voltage - Output (Max): 38V; Current - Output: 300mA (Switch); Frequency - Switching: 3MHz; Synchronous Rectifier: No; Supplier 1: Digi-Key; Supplier Part Number 1: LT3461AES6#TRMPBFCT-ND; RoHS 1: RoHS Compliant; Description 1: IC REG BOOST ADJ 0.3A TSOT23-6; Stock 1: 1325; Pricing 1: 1=3.94, 25=3.52, 100=2.4, 250=2.2 (USD); Packaging: Cut Tape (CT); Part Status: Active; Topology: Boost; Operating Temperature: 0°C ~ 70°C (TA); Mounting Type: Surface Mount; Package / Case: SOT-23-6 Thin, TSOT-23-6; Supplier Device Package: TSOT-23-6; ComponentLink1URL: http://www.linear.com/docs/3469; ComponentLink1Description: http://www.linear.com/docs/3469
P1 = SSW-102-02-G-S-RA: Supplier 1: Digi-Key